# Altium schematic sheet breakout.SchDoc
size A
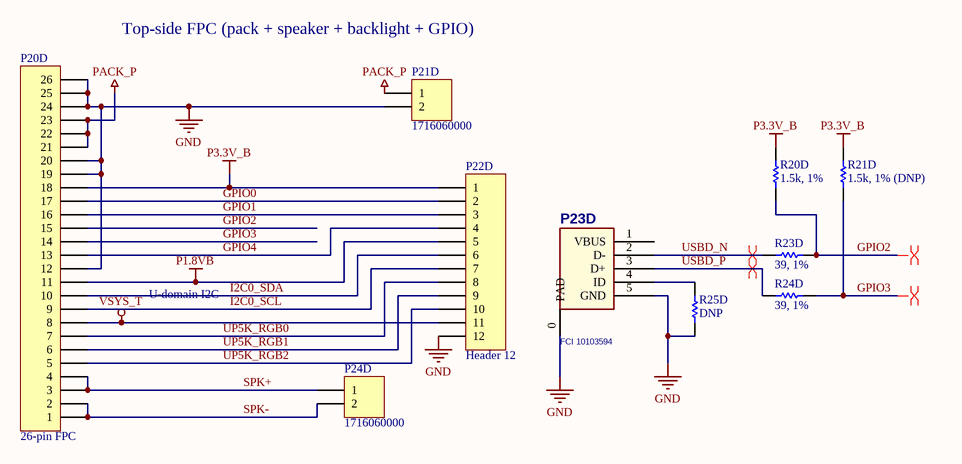
[diagram p0: breakout.SchDoc]

## Parts
P20D  26-pin FPC  [HRS_FH34SRJ-26S-0.5SH(50)]
P21D  1716060000  [weidmuller_1716060000]
P22D  Header 12  [HDR1X12]
P23D  FCI 10103594  [USB_MICRO_B_SMT]
P24D  1716060000  [weidmuller_1716060000]
R20D  1.5k, 1%  [B_RES0402]
R21D  1.5k, 1% (DNP)  [B_RES0402]
R23D  39, 1%  [B_RES0402]
R24D  39, 1%  [B_RES0402]
R25D  DNP  [B_RES0402]

## Nets
GND: P20D.12 P20D.19 P20D.20 P20D.24 P20D.25 P20D.26 P21D.2 P22D.12 P23D.0(PAD) P23D.5(GND) R25D.2
P1.8VB: P20D.11 P22D.5
P3.3V_B: P20D.18 P22D.1 R20D.1 R21D.1
PACK_P: P20D.21 P20D.22 P20D.23 P21D.1
VSYS_T: P20D.8 P22D.11
GPIO0: P20D.17 P22D.2
GPIO1: P20D.16 P22D.3
GPIO2: P20D.15 R20D.2 R23D.1
GPIO3: P20D.14 R21D.2 R24D.1
GPIO4: P20D.13 P22D.4
I2C0_SCL: P20D.9 P22D.7
I2C0_SDA: P20D.10 P22D.6
SPK+: P20D.3 P20D.4 P24D.1
SPK-: P20D.1 P20D.2 P24D.2
UP5K_RGB0: P20D.7 P22D.8
UP5K_RGB1: P20D.6 P22D.9
UP5K_RGB2: P20D.5 P22D.10
USBD_N: P23D.2(D-) R23D.2
USBD_P: P23D.3(D+) R24D.2
NetP23D_4: P23D.4(ID) R25D.1

Not connected (* = marked no-connect by the designer): P23D 1(VBUS)

## Layout directives
differential pair: GPIO2, GPIO3, USBD_N, USBD_P

## Notes on the sheet
- Top-side FPC (pack + speaker + backlight + GPIO)
- U-domain I2C

## Library data of the parts
P20D = FPC-26: 26 Pin FPC header; MPN: FH34SRJ-26S-0.5SH(99); MYPN: J-FPC-0.5mm-26-0.3mm-T/B; VENDOR: Hirose; System: Connector
P21D P24D = Header 2: Header, 2-Pin; VENDOR: Weidmuller; MYPN: J-TB-2P-5.08; LatestRevisionDate: 17-Jul-2002; LatestRevisionNote: Re-released for DXP Platform.; Publisher: Altium Limited; MPN: 1716060000
P22D = Header 12: Header, 12-Pin; LatestRevisionDate: 17-Jul-2002; LatestRevisionNote: Re-released for DXP Platform.; Publisher: Altium Limited
P23D = USB_MINI-AB_1: Micro USB B type connector; MPN: 10103594-0001LF; MYPN: J-MICROUSB-SMT-FCI; VENDOR: FCI
R20D = Res1: Resistor; MPN: RS02U152FT; VENDOR: Fenghua; MYPN: R-152-1P-1_16W-0402
R21D = Res1: Resistor; VENDOR: Fenghua; MYPN: DNP; MPN: DNP
R23D R24D = Res1: Resistor; VENDOR: ANY; MYPN: R-390-1P-1_16W-0402; MPN: ANY
R25D = Res1: Resistor; VENDOR: ANY; MYPN: DNP; MPN: ANY